# Altium schematic sheet PLEN_Control_Logic_pt4.SchDoc
size 420 x 297 mm; Author: ALTIUM GOSTBOM2.0 KEV
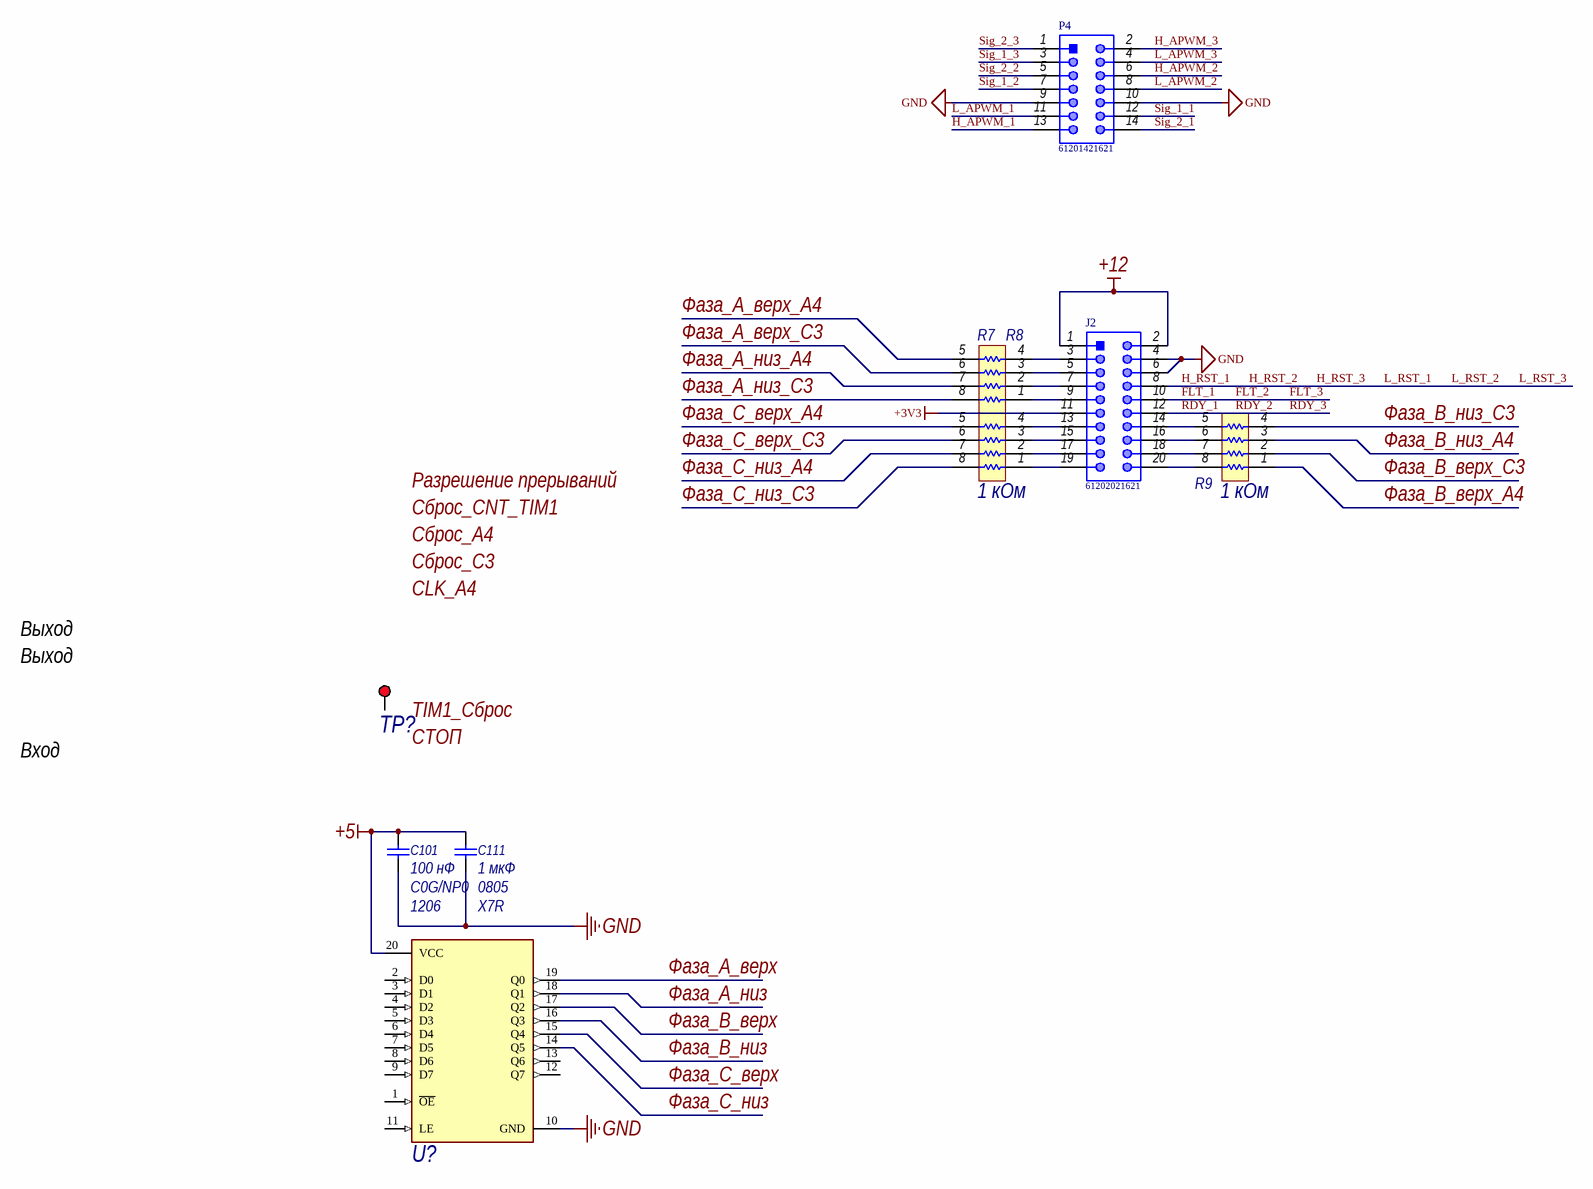
[diagram p0: PLEN_Control_Logic_pt4.SchDoc]

## Parts
C101  value 100 нФ  Dielectric Characteristic: C0G/NP0  Package Reference: 1206  [CAPC3216X180X55NL20T25]  (hidden comment: GRM31C5C1E104JA01L)
C111  value 1 мкФ  Case: 0805  Dielectric: X7R  [CAPC2013X140X50LL20T25]  (hidden comment: C0805C105K3RACTU)
J2  61202021621  [61202021621]
P4  61201421621  [61201421621]
R7  CAT16-103J4LF  [BOUR-CAT16-103J4LF_N]  (value not drawn)
R8  value 1 кОм  [BOUR-CAT16-103J4LF_N]  (hidden comment: CAT16-103J4LF)
R9  value 1 кОм  [BOUR-CAT16-103J4LF_N]  (hidden comment: CAT16-103J4LF)
TP?  5010  [KSTN-5010_V]  (value not drawn)
U?  74HC573D,653  [FP-SOT163-1-MFG]  (value not drawn)

## Nets
+3V3: J2.11
+5: C101.1 C111.2 U?.20(VCC)
+12: J2.1 J2.2
GND: C101.2 C111.1 J2.4 J2.6 P4.9 P4.10 U?.10(GND)
FLT_1: J2.10  [also labelled FLT_2, FLT_3]
H_APWM_1: P4.13
H_APWM_2: P4.6
H_APWM_3: P4.2
H_RST_1: J2.8  [also labelled H_RST_2, H_RST_3, L_RST_1, L_RST_2, L_RST_3]
L_APWM_1: P4.11
L_APWM_2: P4.8
L_APWM_3: P4.4
RDY_1: J2.12  [also labelled RDY_2, RDY_3]
Sig_1_1: P4.12
Sig_1_2: P4.7
Sig_1_3: P4.3
Sig_2_1: P4.14
Sig_2_2: P4.5
Sig_2_3: P4.1
Фаза_A_низ: U?.18(Q1)
Фаза_A_низ_A4: R7.7
Фаза_A_низ_C3: R7.8
Фаза_B_верх: U?.17(Q2)
Фаза_B_верх_A4: R9.1
Фаза_B_верх_C3: R9.2
Фаза_B_низ: U?.16(Q3)
Фаза_B_низ_A4: R9.3
Фаза_B_низ_C3: R9.4
Фаза_C_верх: U?.15(Q4)
Фаза_C_верх_A4: R8.5
Фаза_C_верх_C3: R8.6
Фаза_C_низ: U?.14(Q5)
Фаза_C_низ_A4: R8.7
Фаза_C_низ_C3: R8.8
Фаза_А_верх: U?.19(Q0)
Фаза_А_верх_A4: R7.5
Фаза_А_верх_C3: R7.6
NetJ2_3: J2.3 R7.4
NetJ2_5: J2.5 R7.3
NetJ2_7: J2.7 R7.2
NetJ2_9: J2.9 R7.1
NetJ2_13: J2.13 R8.4
NetJ2_14: J2.14 R9.5
NetJ2_15: J2.15 R8.3
NetJ2_16: J2.16 R9.6
NetJ2_17: J2.17 R8.2
NetJ2_18: J2.18 R9.7
NetJ2_19: J2.19 R8.1
NetJ2_20: J2.20 R9.8

Not connected (* = marked no-connect by the designer): TP? 1; U? 1(~{OE}) 2(D0) 3(D1) 4(D2) 5(D3) 6(D4) 7(D5) 8(D6) 9(D7) 11(LE) 12(Q7) 13(Q6)

## Notes on the sheet
- Выход
- Вход
- Labels drawn without touching a wire or pin: CLK_A4, TIM1_Сброс, Разрешение прерываний, Сброс_A4, Сброс_C3, Сброс_CNT_TIM1, СТОП
- Перв. примен.
- Справ. №
- Подп. дата
- Инв. № дубл.
- Взам. инв. №
- Подп. и дата
- Изм.
- Разраб.
- Лист
- № докум.
- Подп.
- Дата
- Лит.
- Масса
- Масштаб
- Пров.
- Т.контр.
- Листов
- Инв. № подл.
- Н.контр.
- Утв.
- ALTIUM GOSTBOM2.0 KEV
- Файл:
- Копировал
- Формат А3

## Library data of the parts
C101 = CMP-2000-06343-1: Chip Capacitor, 100 nF, +/- 5%, 25 V, -55 to 125 degC, 1206 (3216 Metric), RoHS, Tape and Reel; Manufacturer: Murata; External Width: 0.5mm; Voltage Rating V DC: 25V; Capacitor Case Style: 1206[3216Metric]; Insulation Resistance: 10000Mohm; Capacitor Terminals: SMD; Temperature Coefficient: 0ppm/°C±30ppm/°C; External Length / Height: 1mm; Reel Quantity: 2000; SVHC: NoSVHC(19-Dec-2012); No. of Pins: 2; Manufacturer URL: http://www.murata.com/; Mounting Technology: SurfaceMount; Operating Temperature Range: -55°Cto+125°C; Operating Temperature Max: 125°C; Package Description: 2-Pin Surface Mount Device, Body 3.2 x 1.6 mm; Operating Temperature Min: -55°C; Terminal Type: SurfaceMount(SMD,SMT); MSL: –; Tolerance +: 5%; Voltage Rating: 25V; Datasheet URL: https://datasheet.ciiva.com/3777/11308grm31c5c1e104ja0123-3777177.pdf; Datasheet Version: 09/2014; Package / Case: 1206; Capacitance Tolerance: ±5%; Lead Spacing: –; Tolerance -: 5%
C111 = CMP-2007-03234-1: Manufacturer: Kemet; Part Number: C0805C105K3RACTU
J2 = CMP-1502-00010-1: Male Box Header WR-BHD, THT, Vertical, pitch 2.54 mm, 20 pins; Manufacturer: Wurth Elektronik; Contact Resistance: 20mOhm; Withstanding Voltage: 500VAC; Pitch: 2.54mm; Pin Number: 20; Working Voltage: 250VAC; Orientation: Vertical; Package Reference: 61202021621; Publisher: WurthElektronik; Datasheet URL: https://katalog.we-online.de/em/datasheet/6120xx21621.pdf; Operating Temperature: -40to125degC; Packaging: Tray; Part Number: 61202021621; Mounting Technology: THT; Gender: Male; Manufacturer URL: http://www.we-online.de; Published Date: August2018
P4 = CMP-1502-00008-1: Male Box Header WR-BHD, THT, Vertical, pitch 2.54 mm, 14 pins; Manufacturer: Wurth Elektronik; Contact Resistance: 20mOhm; Pitch: 2.54mm; Pin Number: 14; Withstanding Voltage: 500VAC; Working Voltage: 250VAC; Part Number: 61201421621; Mounting Technology: THT; Datasheet URL: https://katalog.we-online.de/em/datasheet/6120xx21621.pdf; Gender: Male; Manufacturer URL: http://www.we-online.de; Publisher: WurthElektronik; Orientation: Vertical; Operating Temperature: -40to125degC; Packaging: Tray; Published Date: August2018; Package Reference: 61201421621
R7 = CMP-2000-06067-1: CAT / CAY 16 Series - Chip Resistor Array, 10 KOhm, +/- 5%, 50 V, -55 to 125 degC, 8-Pin SMD, RoHS, Tape and Reel; Manufacturer: Bourns; Power Per Element: 62.5mW; Online Catalog: CAT16Series; Value: 1 кОм; Number of Resistors: 4; EDA / CAD Models: DownloadfromAcceleratedDesigns; Temperature Coefficient: ±200ppm/°C; Circuit Type: Isolated; Other Names: CAT16-103J4LFDKR; Package Reference: CAT16-103J4LF; Datasheet Version: 09/2014; Series: CAT16; Manufacturer URL: http://www.bourns.com/; Mounting Type: SurfaceMount; Datasheet URL: http://www.mouser.com/ds/2/54/ATCAY-777361.pdf; Category: Resistors; Height: 0.024"(0.60mm); Mounting Technology: SurfaceMount; Applications: -; Size / Dimension: 0.126"Lx0.061"W(3.20mmx1.55mm); Packaging: Digi-Reel®; Package / Case: 1206(3216Metric),Concave,LongSideTerminals; Supplier Device Package: 1206; RoHS Information: CAT16MaterialDeclaration; Number of Pins: 8; Family: ResistorNetworks,Arrays; Standard Package: 1; Package Description: 8-Pin Surface Mount Device, Body 3.2 x 1.55 mm, Pitch 0.8 mm; Operating Temperature: -55°C~125°C; Tolerance: ±5%
R8 R9 = CMP-2000-06067-1: CAT / CAY 16 Series - Chip Resistor Array, 10 KOhm, +/- 5%, 50 V, -55 to 125 degC, 8-Pin SMD, RoHS, Tape and Reel; Manufacturer: Bourns; Power Per Element: 62.5mW; Online Catalog: CAT16Series; Number of Resistors: 4; EDA / CAD Models: DownloadfromAcceleratedDesigns; Temperature Coefficient: ±200ppm/°C; Circuit Type: Isolated; Other Names: CAT16-103J4LFDKR; Package Reference: CAT16-103J4LF; Datasheet Version: 09/2014; Series: CAT16; Manufacturer URL: http://www.bourns.com/; Mounting Type: SurfaceMount; Datasheet URL: http://www.mouser.com/ds/2/54/ATCAY-777361.pdf; Category: Resistors; Height: 0.024"(0.60mm); Mounting Technology: SurfaceMount; Applications: -; Size / Dimension: 0.126"Lx0.061"W(3.20mmx1.55mm); Packaging: Digi-Reel®; Package / Case: 1206(3216Metric),Concave,LongSideTerminals; Supplier Device Package: 1206; RoHS Information: CAT16MaterialDeclaration; Number of Pins: 8; Family: ResistorNetworks,Arrays; Standard Package: 1; Package Description: 8-Pin Surface Mount Device, Body 3.2 x 1.55 mm, Pitch 0.8 mm; Operating Temperature: -55°C~125°C; Tolerance: ±5%
TP? = CMP-1672-00002-4: Test Point, Red, Through Hole, RoHS, Bulk; Manufacturer: Keystone; Contact Material: Bronze; Mounting Technology: Through Hole; RoHSCompliant: true; Pins: 1; Package Quantity: 100; ComponentLink2Description: Datasheet; Height: 8.12 mm; ComponentLink1URL: http://www.keyelco.com/; DatasheetVersion: Rev. F, 12/2013; Mount: Through Hole; PackageReference: 5010; Contact Plating: Silver; Packaging: Bulk; Colour: Red; REACH SVHC: No SVHC; PackageDescription: 1-Pin Through Hole Device, Dia 3.17 mm; ComponentLink2URL: http://www.keyelco.com/product-pdf.cfm?p=1319; ComponentLink1Description: Manufacturer URL
U? = CMP-14349-000004-1: IC LATCH OCTAL D 3STATE 20SOIC; RoHS Compliant: Yes